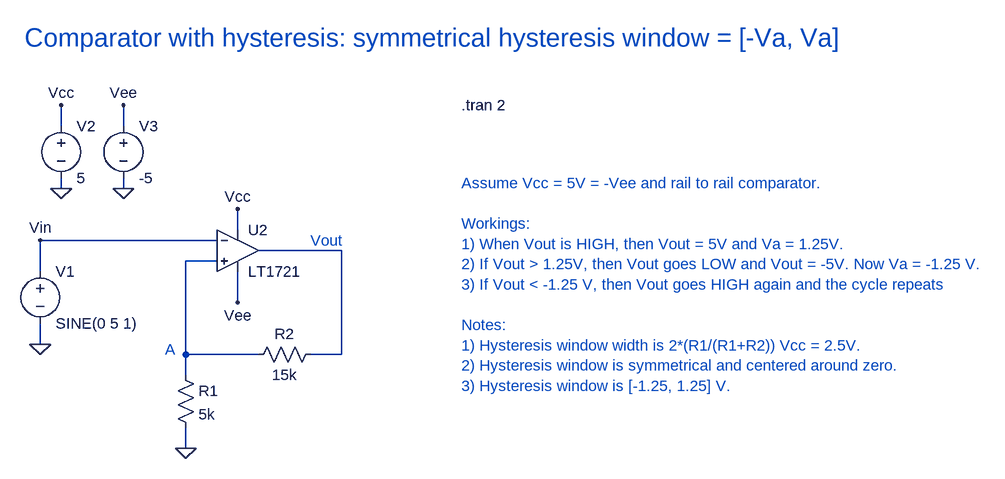
[diagram p0: schematic Comparator-with-hysteresis-symmetrical-window.asc]
Comparator-with-hysteresis-symmetrical-window.asc, the LTspice schematic file:
Version 4
SHEET 1 1452 680
WIRE 16 -48 16 -80
WIRE 112 -48 112 -80
WIRE 16 48 16 32
WIRE 112 48 112 32
WIRE 288 112 288 80
WIRE 256 128 -16 128
WIRE 448 144 320 144
WIRE 256 160 208 160
WIRE -16 176 -16 128
WIRE 288 224 288 176
WIRE -16 288 -16 256
WIRE 208 304 208 160
WIRE 320 304 208 304
WIRE 448 304 448 144
WIRE 448 304 400 304
WIRE 208 336 208 304
WIRE 208 448 208 416
FLAG 16 48 0
FLAG 16 -80 Vcc
FLAG 288 80 Vcc
FLAG -16 288 0
FLAG 208 448 0
FLAG -16 128 Vin
FLAG 112 48 0
FLAG 112 -80 Vee
FLAG 288 224 Vee
SYMBOL voltage -16 160 R0
WINDOW 123 0 0 Left 0
WINDOW 39 0 0 Left 0
SYMATTR InstName V1
SYMATTR Value SINE(0 5 1)
SYMBOL voltage 16 -64 R0
WINDOW 123 0 0 Left 0
WINDOW 39 0 0 Left 0
SYMATTR InstName V2
SYMATTR Value 5
SYMBOL res 192 320 R0
SYMATTR InstName R1
SYMATTR Value 5k
SYMBOL res 416 288 R90
WINDOW 0 0 56 VBottom 2
WINDOW 3 32 56 VTop 2
SYMATTR InstName R2
SYMATTR Value 15k
SYMBOL voltage 112 -64 R0
WINDOW 123 0 0 Left 0
WINDOW 39 0 0 Left 0
SYMATTR InstName V3
SYMATTR Value -5
SYMBOL Comparators\\LT1721 288 80 R0
SYMATTR InstName U2
TEXT 632 -80 Left 2 !.tran 2
TEXT -40 -184 Left 4 ;Comparator with hysteresis: symmetrical hysteresis window = [-Va, Va]
TEXT 632 40 Left 2 ;Assume Vcc = 5V = -Vee and rail to rail comparator.\n \nWorkings:\n1) When Vout is HIGH, then Vout = 5V and Va = 1.25V.\n2) If Vout > 1.25V, then Vout goes LOW and Vout = -5V. Now Va = -1.25 V.\n3) If Vout < -1.25 V, then Vout goes HIGH again and the cycle repeats\n \nNotes:\n1) Hysteresis window width is 2*(R1/(R1+R2)) Vcc = 2.5V.\n2) Hysteresis window is symmetrical and centered around zero.\n3) Hysteresis window is [-1.25, 1.25] V.
TEXT 176 296 Left 2 ;A
TEXT 400 128 Left 2 ;Vout

The netlist it stands for:
* Comparator-with-hysteresis-symmetrical-window.asc
V1 Vin 0 SINE(0 5 1)
V2 Vcc 0 5
R1 N002 0 5k
R2 N001 N002 15k
V3 Vee 0 -5
XU2 N002 Vin Vcc Vee N001 LT1720  ; LT1721, pins In+ In- V+ V- OUT
.tran 2
* Comparator with hysteresis: symmetrical hysteresis window = [-Va, Va]
* Assume Vcc = 5V = -Vee and rail to rail comparator.
* Workings:
* 1) When Vout is HIGH, then Vout = 5V and Va = 1.25V.
* 2) If Vout > 1.25V, then Vout goes LOW and Vout = -5V. Now Va = -1.25 V.
* 3) If Vout < -1.25 V, then Vout goes HIGH again and the cycle repeats
* Notes:
* 1) Hysteresis window width is 2*(R1/(R1+R2)) Vcc = 2.5V.
* 2) Hysteresis window is symmetrical and centered around zero.
* 3) Hysteresis window is [-1.25, 1.25] V.
* A
* Vout
.lib LTC.lib
.backanno
.end